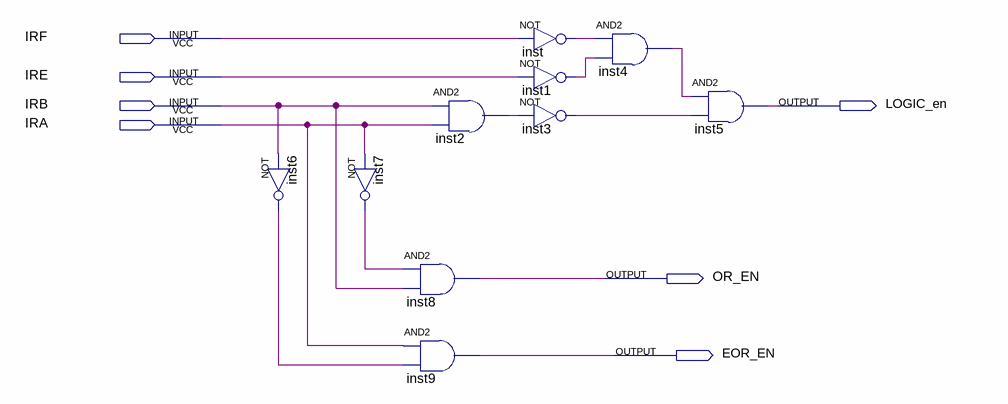
[diagram p0: schematic sheet]
// Quartus schematic LOGIC_EN.bdf as structural Verilog: 10 symbols, 7 pins
module LOGIC_EN (
  input  IRF,
  input  IRE,
  input  IRB,
  input  IRA,
  output LOGIC_en,
  output OR_EN,
  output EOR_EN
);

  wire inst1_out, inst2_out, inst3_out, inst4_out, inst6_out, inst7_out, inst_out;

  not inst6 (inst6_out, IRB);
  not inst7 (inst7_out, IRA);
  and inst2 (inst2_out, IRB, IRA);
  and inst8 (OR_EN, inst7_out, IRB);
  and inst9 (EOR_EN, IRA, inst6_out);
  not inst (inst_out, IRF);
  not inst1 (inst1_out, IRE);
  not inst3 (inst3_out, inst2_out);
  and inst4 (inst4_out, inst_out, inst1_out);
  and inst5 (LOGIC_en, inst4_out, inst3_out);
endmodule
